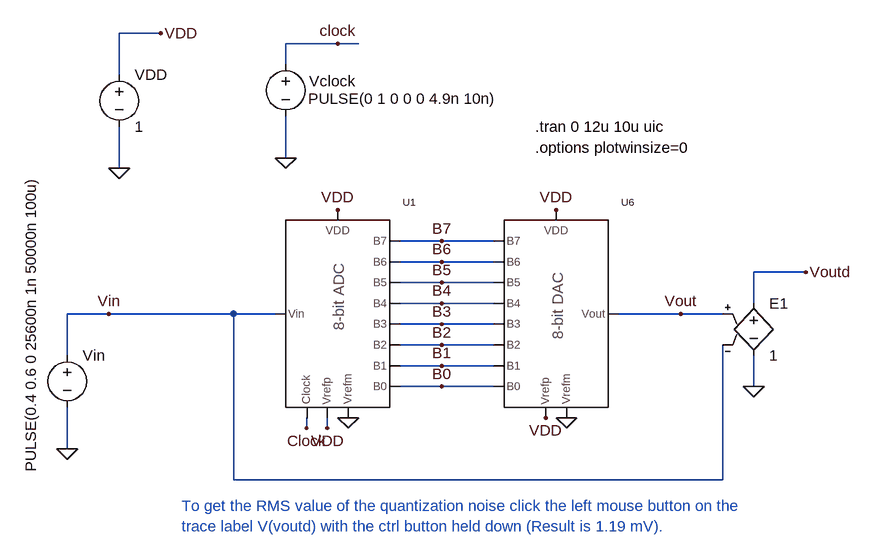
[diagram p0: schematic _Fig5_10_MSD.asc]
_Fig5_10_MSD.asc, the LTspice schematic file:
Version 4
SHEET 1 2740 696
WIRE 592 -816 528 -816
WIRE 864 -800 784 -800
WIRE 896 -800 864 -800
WIRE 784 -768 784 -800
WIRE 528 -752 528 -816
WIRE 784 -624 784 -688
WIRE 528 -608 528 -672
WIRE 1024 -496 960 -496
WIRE 1104 -496 1024 -496
WIRE 1024 -464 960 -464
WIRE 1104 -464 1024 -464
WIRE 1584 -448 1504 -448
WIRE 1024 -432 960 -432
WIRE 1104 -432 1024 -432
WIRE 1024 -400 960 -400
WIRE 1104 -400 1024 -400
WIRE 1504 -400 1504 -448
WIRE 512 -384 448 -384
WIRE 704 -384 512 -384
WIRE 768 -384 704 -384
WIRE 1392 -384 1296 -384
WIRE 1456 -384 1392 -384
WIRE 1024 -368 960 -368
WIRE 1104 -368 1024 -368
WIRE 1024 -336 960 -336
WIRE 1104 -336 1024 -336
WIRE 448 -320 448 -384
WIRE 1024 -304 960 -304
WIRE 1104 -304 1024 -304
WIRE 1024 -272 960 -272
WIRE 1104 -272 1024 -272
WIRE 1504 -272 1504 -320
WIRE 816 -208 816 -224
WIRE 848 -208 848 -224
WIRE 448 -176 448 -240
WIRE 704 -128 704 -384
WIRE 1456 -128 1456 -336
WIRE 1456 -128 704 -128
FLAG 448 -176 0
FLAG 512 -384 Vin
FLAG 784 -624 0
FLAG 864 -800 clock
FLAG 528 -608 0
FLAG 592 -816 VDD
FLAG 1392 -384 Vout
FLAG 1184 -224 VDD
FLAG 1216 -224 0
FLAG 1024 -496 B7
FLAG 1024 -464 B6
FLAG 1024 -432 B5
FLAG 1024 -400 B4
FLAG 1024 -368 B3
FLAG 1024 -336 B2
FLAG 1024 -304 B1
FLAG 1024 -272 B0
FLAG 1200 -544 VDD
FLAG 864 -544 VDD
FLAG 880 -224 0
FLAG 816 -208 Clock
FLAG 848 -208 VDD
FLAG 1504 -272 0
FLAG 1584 -448 Voutd
SYMBOL voltage 448 -336 R0
WINDOW 123 0 0 Left 0
WINDOW 39 0 0 Left 0
WINDOW 3 -56 196 VLeft 0
SYMATTR Value PULSE(0.4 0.6 0 25600n 1n 50000n 100u)
SYMATTR InstName Vin
SYMBOL voltage 784 -784 R0
WINDOW 0 36 42 Left 0
WINDOW 3 35 69 Left 0
WINDOW 123 0 0 Left 0
WINDOW 39 0 0 Left 0
SYMATTR InstName Vclock
SYMATTR Value PULSE(0 1 0 0 0 4.9n 10n)
SYMBOL voltage 528 -768 R0
WINDOW 123 0 0 Left 0
WINDOW 39 0 0 Left 0
SYMATTR InstName VDD
SYMATTR Value 1
SYMBOL Ideal_8_bit_DAC 1120 -240 R0
SYMATTR InstName U6
SYMBOL Ideal_8_bit_ADC 784 -240 R0
SYMATTR InstName U1
SYMBOL e 1504 -416 R0
SYMATTR InstName E1
SYMATTR Value 1
TEXT 1168 -672 Left 0 !.tran 0 12u 10u uic
TEXT 624 -88 Left 0 ;To get the RMS value of the quantization noise click the left mouse button on the \ntrace label V(voutd) with the ctrl button held down (Result is 1.19 mV).
TEXT 1168 -640 Left 0 !.options plotwinsize=0

The netlist it stands for:
* _Fig5_10_MSD.asc
Vin Vin 0 PULSE(0.4 0.6 0 25600n 1n 50000n 100u)
Vclock clock 0 PULSE(0 1 0 0 0 4.9n 10n)
VDD VDD 0 1
XU6 B7 B6 B5 B4 B3 B2 B1 B0 Vout VDD 0 VDD Ideal_8_bit_DAC  ; pins B7 B6 B5 B4 B3 B2 B1 B0 Vout Vrefp Vrefm VDD
XU1 B7 B6 B5 B4 B3 B2 B1 B0 Vin VDD 0 clock VDD Ideal_8_bit_ADC  ; pins B7 B6 B5 B4 B3 B2 B1 B0 Vin Vrefp Vrefm Clock VDD
E1 Voutd 0 Vout Vin 1
.tran 0 12u 10u uic
* To get the RMS value of the quantization noise click the left mouse button on the
* trace label V(voutd) with the ctrl button held down (Result is 1.19 mV).
.options plotwinsize=0
.backanno
.end